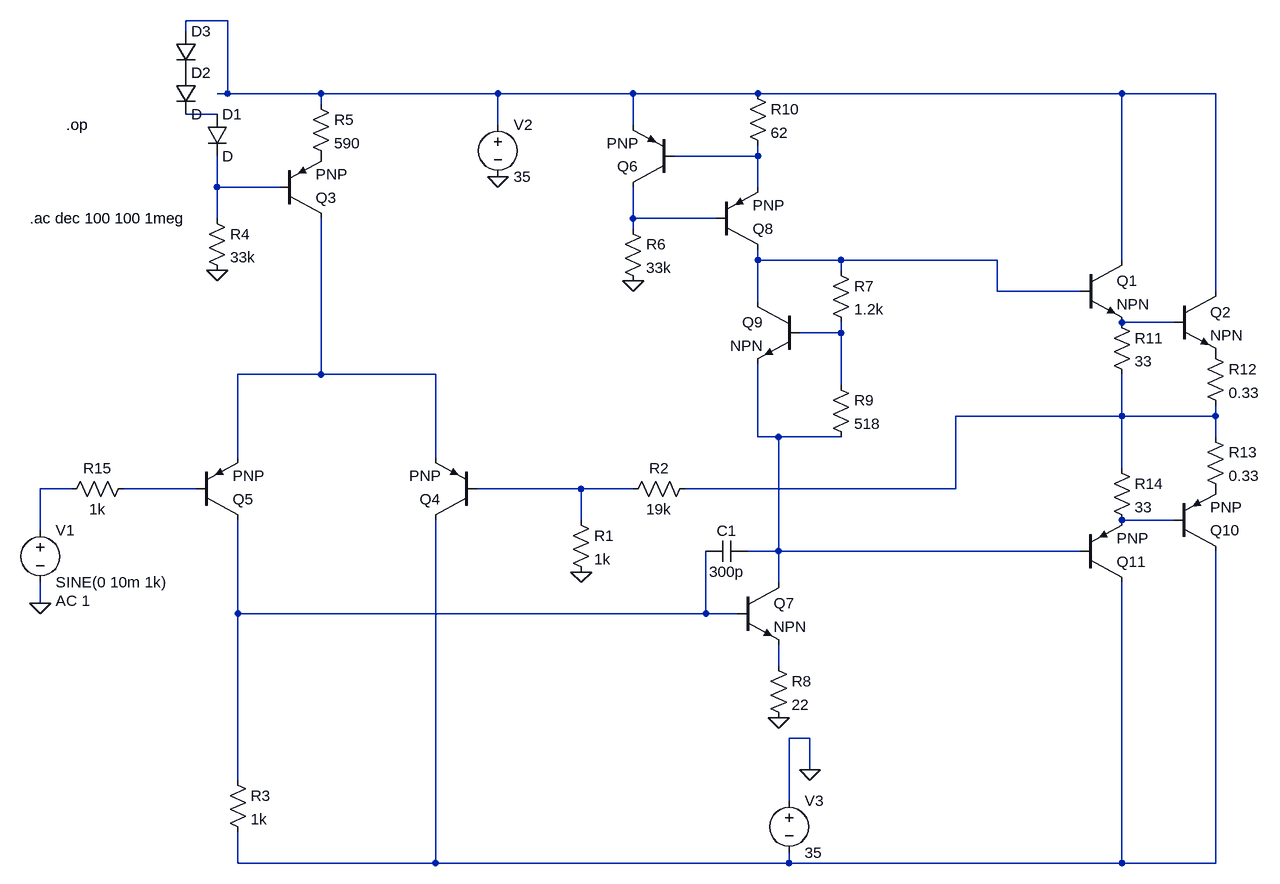
[diagram p0: schematic Ampli_libro.asc]
Ampli_libro.asc, the LTspice schematic file:
Version 4
SHEET 1 880 680
WIRE -2160 -960 -2224 -960
WIRE -2224 -944 -2224 -960
WIRE -2160 -848 -2160 -960
WIRE -2160 -848 -2176 -848
WIRE -2016 -848 -2160 -848
WIRE -1744 -848 -2016 -848
WIRE -1536 -848 -1744 -848
WIRE -1344 -848 -1536 -848
WIRE -784 -848 -1344 -848
WIRE -640 -848 -784 -848
WIRE -2016 -832 -2016 -848
WIRE -2176 -816 -2224 -816
WIRE -1744 -800 -1744 -848
WIRE -1536 -800 -1536 -848
WIRE -1344 -752 -1344 -768
WIRE -1344 -752 -1472 -752
WIRE -2176 -704 -2176 -752
WIRE -2080 -704 -2176 -704
WIRE -1344 -704 -1344 -752
WIRE -2176 -656 -2176 -704
WIRE -1536 -656 -1536 -704
WIRE -1408 -656 -1536 -656
WIRE -1536 -640 -1536 -656
WIRE -1344 -592 -1344 -608
WIRE -1216 -592 -1344 -592
WIRE -976 -592 -1216 -592
WIRE -784 -592 -784 -848
WIRE -1216 -576 -1216 -592
WIRE -976 -544 -976 -592
WIRE -848 -544 -976 -544
WIRE -640 -544 -640 -848
WIRE -1344 -528 -1344 -592
WIRE -704 -496 -784 -496
WIRE -1216 -480 -1216 -496
WIRE -1216 -480 -1280 -480
WIRE -2016 -416 -2016 -656
WIRE -2016 -416 -2144 -416
WIRE -1840 -416 -2016 -416
WIRE -1216 -400 -1216 -480
WIRE -784 -352 -784 -416
WIRE -784 -352 -1040 -352
WIRE -640 -352 -640 -368
WIRE -640 -352 -784 -352
WIRE -1344 -320 -1344 -432
WIRE -1312 -320 -1344 -320
WIRE -1216 -320 -1312 -320
WIRE -640 -320 -640 -352
WIRE -2144 -288 -2144 -416
WIRE -1840 -288 -1840 -416
WIRE -784 -272 -784 -352
WIRE -2400 -240 -2448 -240
WIRE -2208 -240 -2320 -240
WIRE -1616 -240 -1776 -240
WIRE -1536 -240 -1616 -240
WIRE -1040 -240 -1040 -352
WIRE -1040 -240 -1456 -240
WIRE -1616 -192 -1616 -240
WIRE -704 -192 -784 -192
WIRE -2448 -176 -2448 -240
WIRE -1312 -144 -1312 -320
WIRE -1312 -144 -1360 -144
WIRE -848 -144 -1312 -144
WIRE -1312 -96 -1312 -144
WIRE -2448 -64 -2448 -96
WIRE -2144 -48 -2144 -192
WIRE -1424 -48 -1424 -144
WIRE -1424 -48 -2144 -48
WIRE -1376 -48 -1424 -48
WIRE -1312 32 -1312 0
WIRE -1264 144 -1296 144
WIRE -1264 192 -1264 144
WIRE -2144 208 -2144 -48
WIRE -1296 240 -1296 144
WIRE -2144 336 -2144 288
WIRE -1840 336 -1840 -192
WIRE -1840 336 -2144 336
WIRE -1296 336 -1296 320
WIRE -1296 336 -1840 336
WIRE -784 336 -784 -96
WIRE -784 336 -1296 336
WIRE -640 336 -640 -144
WIRE -640 336 -784 336
FLAG -1616 -112 0
FLAG -2448 -64 0
FLAG -1744 -720 0
FLAG -1264 192 0
FLAG -1312 112 0
FLAG -2176 -576 0
FLAG -1536 -560 0
SYMBOL res -1632 -208 R0
SYMATTR InstName R1
SYMATTR Value 1k
SYMBOL res -1440 -256 R90
WINDOW 0 0 56 VBottom 2
WINDOW 3 32 56 VTop 2
SYMATTR InstName R2
SYMATTR Value 19k
SYMBOL res -2160 192 R0
SYMATTR InstName R3
SYMATTR Value 1k
SYMBOL voltage -2448 -192 R0
WINDOW 123 24 124 Left 2
WINDOW 39 0 0 Left 2
SYMATTR Value2 AC 1
SYMATTR InstName V1
SYMATTR Value SINE(0 10m 1k)
SYMBOL voltage -1744 -816 R0
SYMATTR InstName V2
SYMATTR Value 35
SYMBOL voltage -1296 224 R0
SYMATTR InstName V3
SYMATTR Value 35
SYMBOL npn -1376 -96 R0
SYMATTR InstName Q7
SYMBOL res -1328 16 R0
SYMATTR InstName R8
SYMATTR Value 22
SYMBOL pnp -1776 -192 R180
SYMATTR InstName Q4
SYMBOL pnp -2208 -192 M180
SYMATTR InstName Q5
SYMBOL cap -1360 -160 R90
WINDOW 0 0 32 VBottom 2
WINDOW 3 32 32 VTop 2
SYMATTR InstName C1
SYMATTR Value 300p
SYMBOL npn -704 -544 R0
SYMATTR InstName Q2
SYMBOL diode -2192 -816 R0
SYMATTR InstName D1
SYMBOL res -2192 -672 R0
SYMATTR InstName R4
SYMATTR Value 33k
SYMBOL res -2032 -848 R0
SYMATTR InstName R5
SYMATTR Value 590
SYMBOL pnp -2080 -656 M180
SYMATTR InstName Q3
SYMBOL pnp -1472 -704 R180
SYMATTR InstName Q6
SYMBOL pnp -1408 -608 M180
SYMATTR InstName Q8
SYMBOL res -1552 -656 R0
SYMATTR InstName R6
SYMATTR Value 33k
SYMBOL npn -1280 -528 M0
SYMATTR InstName Q9
SYMBOL res -1232 -592 R0
SYMATTR InstName R7
SYMATTR Value 1.2k
SYMBOL res -1232 -416 R0
SYMATTR InstName R9
SYMATTR Value 518
SYMBOL res -1360 -864 R0
SYMATTR InstName R10
SYMATTR Value 62
SYMBOL pnp -704 -144 M180
SYMATTR InstName Q10
SYMBOL pnp -848 -96 M180
SYMATTR InstName Q11
SYMBOL npn -848 -592 R0
SYMATTR InstName Q1
SYMBOL res -800 -512 R0
SYMATTR InstName R11
SYMATTR Value 33
SYMBOL res -656 -464 R0
SYMATTR InstName R12
SYMATTR Value 0.33
SYMBOL res -656 -336 R0
SYMATTR InstName R13
SYMATTR Value 0.33
SYMBOL res -800 -288 R0
SYMATTR InstName R14
SYMATTR Value 33
SYMBOL diode -2240 -880 R0
SYMATTR InstName D2
SYMBOL diode -2240 -944 R0
SYMATTR InstName D3
SYMBOL res -2304 -256 R90
WINDOW 0 0 56 VBottom 2
WINDOW 3 32 56 VTop 2
SYMATTR InstName R15
SYMATTR Value 1k
TEXT -2464 -656 Left 2 !.ac dec 100 100 1meg
TEXT -2408 -800 Left 2 !.op

The netlist it stands for:
* Ampli_libro.asc
R1 N014 0 1k
R2 N010 N014 19k
R3 N016 N018 1k
V1 N012 0 SINE(0 10m 1k) AC 1
V2 N001 0 35
V3 0 N018 35
Q7 N011 N016 N017 0 NPN
R8 N017 0 22
Q4 N018 N014 N009 0 PNP
Q5 N016 N013 N009 0 PNP
C1 N011 N016 300p
Q2 N001 N007 P001 0 NPN
D1 N002 N004 D
R4 N004 0 33k
R5 N001 P002 590
Q3 N009 N004 P002 0 PNP
Q6 N005 N003 N001 0 PNP
Q8 N006 N005 N003 0 PNP
R6 N005 0 33k
Q9 N006 N008 N011 0 NPN
R7 N006 N008 1.2k
R9 N008 N011 518
R10 N001 N003 62
Q10 N018 N015 P003 0 PNP
Q11 N018 N011 N015 0 PNP
Q1 N001 N006 N007 0 NPN
R11 N007 N010 33
R12 P001 N010 0.33
R13 N010 P003 0.33
R14 N010 N015 33
D2 P004 N002 D
D3 N001 P004 D
R15 N013 N012 1k
.model D D
.lib standard.dio
.model NPN NPN
.model PNP PNP
.lib standard.bjt
.ac dec 100 100 1meg
.op
.backanno
.end